# Altium project YLCmarlin1.PrjPCB
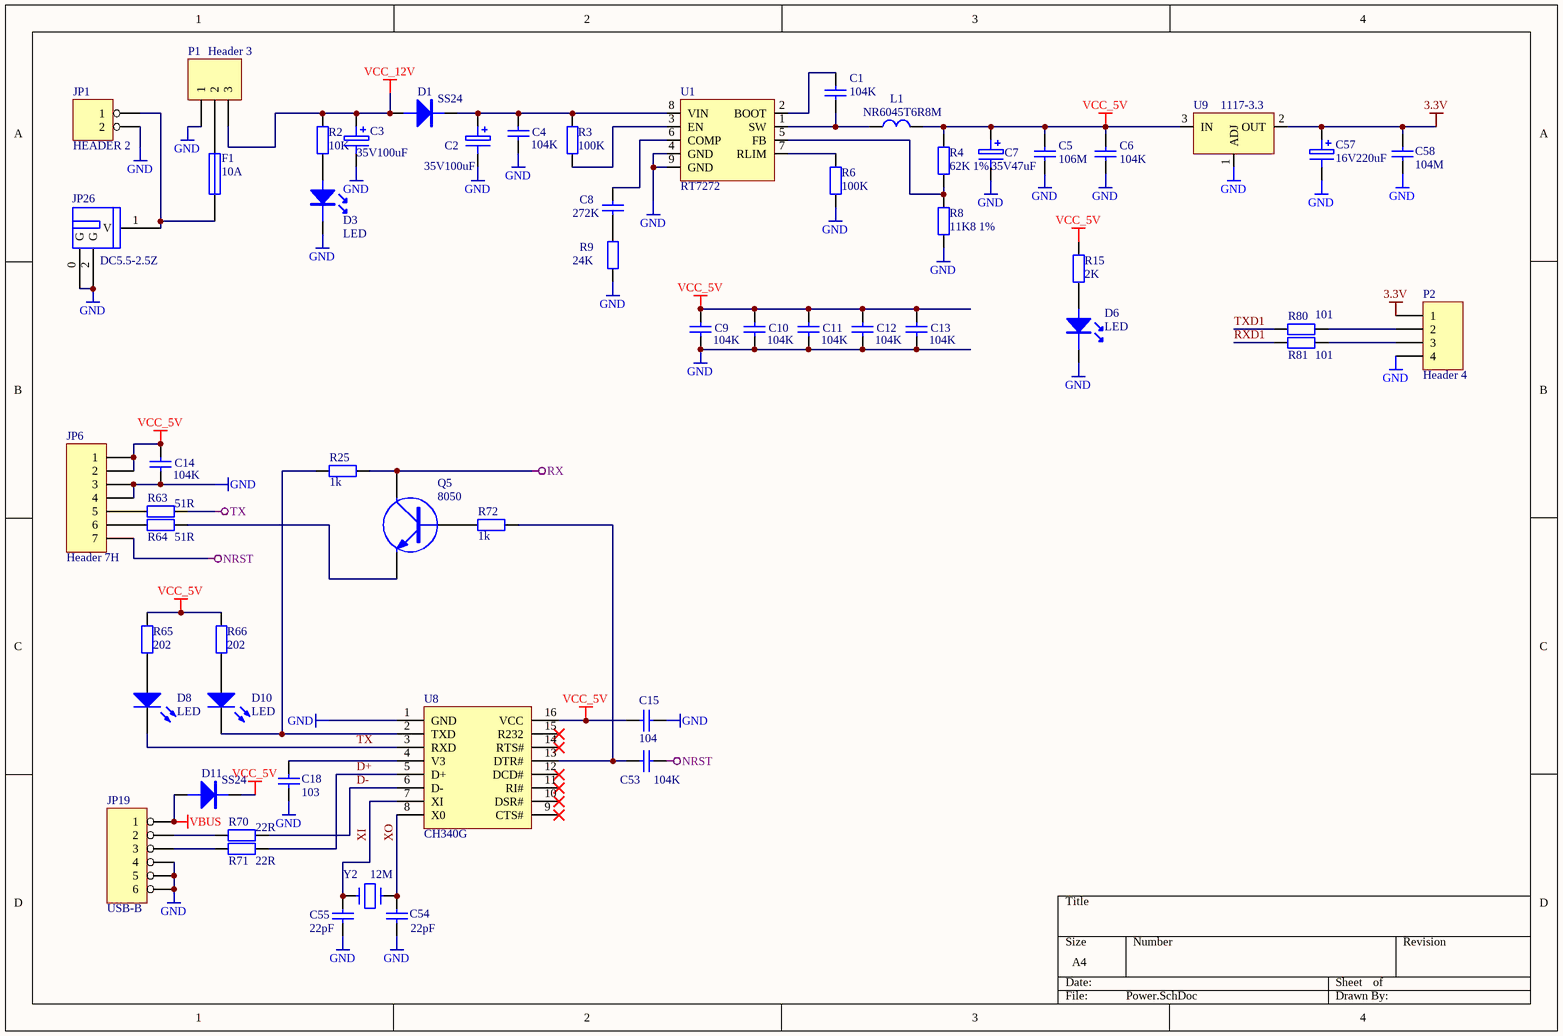
[diagram p0: Power.SchDoc]
4 sheets, 209 parts. Net scope: global (net labels, ports and power ports of the same name join across sheets).
Board file: YLCmarlin.PcbDoc
Sheets:
  Power.SchDoc
  MCU.SchDoc
  MOTO1.SchDoc
  misc.SchDoc

## Sheet Power.SchDoc
size A4

### Parts
C1  104K  [0805(CS)]
C2  35V100uF  [F6]
C3  35V100uF  [F6]
C4  104K  [0805(C)]
C5  106M  [0603(C)]
C6  104K  [0805(CS)]
C7  35V47uF  [F6]
C8  272K  [0603(C)]
C9  104K  [0805(CS)]
C10  104K  [0805(CS)]
C11  104K  [0805(CS)]
C12  104K  [0805(CS)]
C13  104K  [0805(CS)]
C14  104K  [0805(CS)]
C15  104  [0805(CS)]
C18  103  [0603(C)]
C53  104K  [0805(CS)]
C54  22pF  [0603(C)]
C55  22pF  [0603(C)]
C57  16V220uF  [F6]
C58  104M  [0603(C)]
D1  SS24  [SMA]
D3  LED  [LED-SMD-0805]
D6  LED  [LED-SMD-0805]
D8  LED  [LED-SMD-0805]
D10  LED  [LED-SMD-0805]
D11  SS24  [SMA]
F1  10A  [1206(F)]
JP1  HEADER 2  [POWER JACK-2*5.0]
JP6  Header 7H  [XH2.54-7P]
JP19  USB-B  [USBBW]
JP26  DC5.5-2.5Z  [DC-528]
L1  NR6045T6R8M  [COKE_6X6]
P1  Header 3  [POWER JACK-3*5.0]
P2  Header 4  [HDR1X4]
Q5  8050  [SOT23]
R2  10K  [0603(R)]
R3  100K  [0603(R)]
R4  62K 1%  [0603(R)]
R6  100K  [0603(R)]
R8  11K8 1%  [0603(R)]
R9  24K  [0603(R)]
R15  2K  [0603(R)]
R25  1k  [0603(R)]
R63  51R  [0603(R)]
R64  51R  [0603(R)]
R65  202  [0603(R)]
R66  202  [0603(R)]
R70  22R  [0603(R)]
R71  22R  [0603(R)]
R72  1k  [0603(R)]
R80  101  [0603(R)]
R81  101  [0603(R)]
U1  RT7272  [SO8-EP]
U8  CH340G  [SO-16]
U9  1117-3.3  [SOT223-1117]
Y2  12M  [CRYS-SMD-5032-2P]

### Nets
3.3V: C57.1 C58.2 P2.1 U9.2(OUT)
GND: C2.2 C3.2 C4.1 C5.1 C6.1 C7.2 C9.1 C10.1 C11.1 C12.1 C13.1 C14.1 C15.1 C18.1 C54.2 C55.2 C57.2 C58.1 D3.2 D6.2 JP1.2 JP6.3 JP6.4 JP19.4 JP19.5 JP19.6 JP26.0(G) JP26.2(G) P1.1 P2.4 R6.2 R8.2 R9.2 U1.4(GND) U1.9(GND) U8.1(GND) U9.1(ADJ)
NRST: C53.2 JP6.7
RX: Q5.3(C) R25.1
TX: D8.2(K) R63.2 U8.3(RXD)
VBUS: D11.1 JP19.1
VCC_5V: C5.2 C6.2 C7.1 C9.2 C10.2 C11.2 C12.2 C13.2 C14.2 C15.2 D11.2 JP6.1 JP6.2 L1.2 R4.1 R15.1 R65.2 R66.2 U8.16(VCC) U9.3(IN)
VCC_12V: C3.1 D1.1 P1.3 R2.1
D+: R71.2 U8.5(D+)
D-: R70.2 U8.6(D-)
RXD1: R81.1
TXD1: R80.1
XI: C55.1 U8.7(XI) Y2.1
XO: C54.1 U8.8(X0) Y2.2
NetC1_1: C1.1 L1.1 U1.1(SW)
NetC1_2: C1.2 U1.2(BOOT)
NetC2_1: C2.1 C4.2 D1.2 R3.1 U1.8(VIN)
NetC8_1: C8.1 R9.1
NetC8_2: C8.2 U1.6(COMP)
NetC18_2: C18.2 U8.4(V3)
NetC53_1: C53.1 R72.1 U8.13(DTR#)
NetD3_1: D3.1 R2.2
NetD6_1: D6.1 R15.2
NetD8_1: D8.1(A) R65.1
NetD10_1: D10.1(A) R66.1
NetD10_2: D10.2(K) R25.2 U8.2(TXD)
NetF1_1: F1.1 P1.2
NetF1_2: F1.2 JP1.1 JP26.1(V)
NetJP6_5: JP6.5 R63.1
NetJP6_6: JP6.6 R64.1
NetJP19_2: JP19.2 R70.1
NetJP19_3: JP19.3 R71.1
NetP2_2: P2.2 R80.2
NetP2_3: P2.3 R81.2
NetQ5_1: Q5.1(B) R72.2
NetQ5_2: Q5.2(E) R64.2
NetR3_2: R3.2 U1.3(EN)
NetR4_2: R4.2 R8.1 U1.5(FB)
NetR6_1: R6.1 U1.7(RLIM)

Not connected (* = marked no-connect by the designer): U8 9(CTS#)* 10(DSR#)* 11(RI#)* 12(DCD#)* 14(RTS#)* 15(R232)*

### Library data of the parts
C1 C4-C6 C8-C14 C58 = Cap: Capacitor; Value: 104; Published: 8-Jun-2000; LatestRevisionDate: 17-Jul-2002; LatestRevisionNote: Re-released for DXP Platform.; PackageReference: RAD-0.3; Publisher: Altium Limited; PackageDescription: Radial Cap, Thru-Hole; 2 Leads; 0.3 in Pin Spacing
C2 C3 C7 C57 = ELECTRO1: Electrolytic Capacitor
C15 C18 = CAP: Capacitor; Value: 0.1UF; Published: 8-Jun-2000; LatestRevisionDate: 17-Jul-2002; LatestRevisionNote: Re-released for DXP Platform.; PackageReference: RAD-0.3; Publisher: Altium Limited
C53-C55 = Cap: Capacitor; Value: 30pF; Published: 8-Jun-2000; LatestRevisionDate: 17-Jul-2002; LatestRevisionNote: Re-released for DXP Platform.; PackageReference: RAD-0.3; Publisher: Altium Limited; PackageDescription: Radial Cap, Thru-Hole; 2 Leads; 0.3 in Pin Spacing
D1 D11 = DIODE
D8 D10 = LED1: Typical RED GaAs LED; Published: 8-Jun-2000; LatestRevisionDate: 08-Jul-2005; LatestRevisionNote: Mech Layer 1 removed.; PackageReference: LED-1; Publisher: Altium Limited; PackageDescription: LED; 2 Leads
F1 = FUSE1: Fuse
JP6 = Header 7H: Header, 7-Pin, Right Angle; LatestRevisionDate: 17-Jul-2002; LatestRevisionNote: Re-released for DXP Platform.; Publisher: Altium Limited
JP19 = HEADER 6
L1 = INDUCTOR
P1 = Header 3: Header, 3-Pin; LatestRevisionDate: 17-Jul-2002; LatestRevisionNote: Re-released for DXP Platform.; Publisher: Altium Limited
P2 = Header 4: Header, 4-Pin; LatestRevisionDate: 17-Jul-2002; LatestRevisionNote: Re-released for DXP Platform.; Publisher: Altium Limited
Q5 = NPN: NPN Transistor
R2-R4 R6 R8 R9 R15 R25 R63-R66 R70-R72 R80 R81 = Res2: Resistor; Value: 1K5; Published: 8-Jun-2000; LatestRevisionDate: 17-Jul-2002; LatestRevisionNote: Re-released for DXP Platform.; PackageReference: AXIAL-0.4; Publisher: Altium Limited; PackageDescription: Axial Device, Thru-Hole; 2 Leads; 0.4 in Pin Spacing
U9 = 1117
Y2 = CRYSTAL

## Sheet MCU.SchDoc
size A4
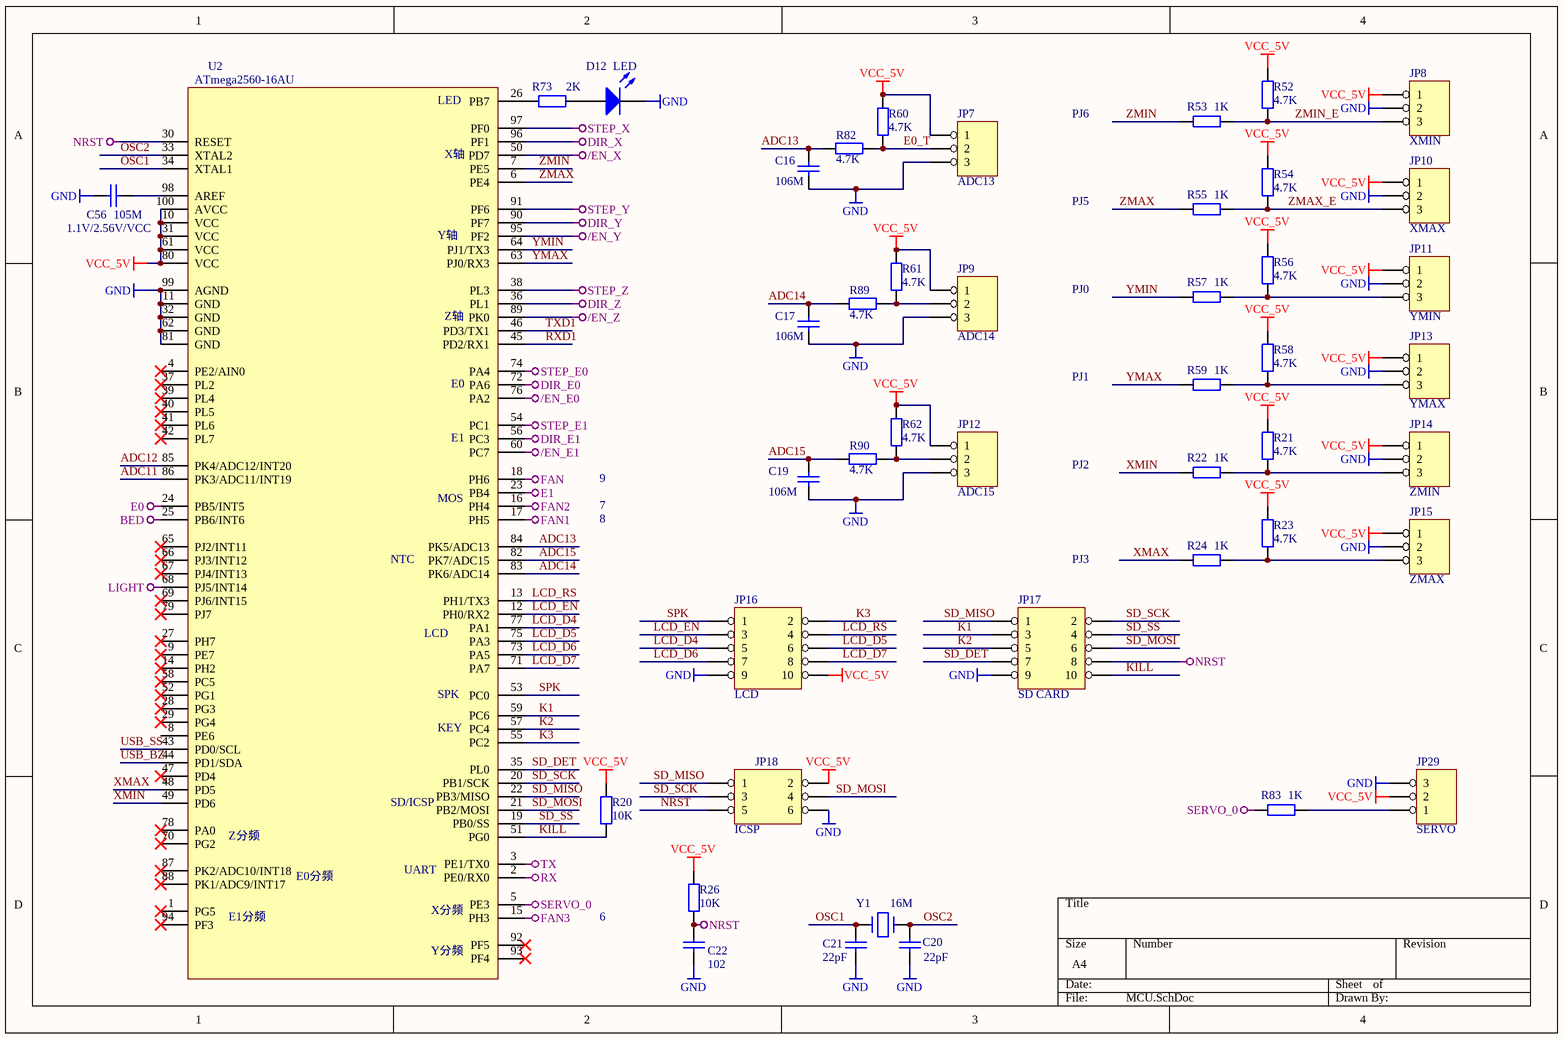
[diagram p1: MCU.SchDoc]

### Parts
C16  106M  [0603(C)]
C17  106M  [0603(C)]
C19  106M  [0603(C)]
C20  22pF  [0603(C)]
C21  22pF  [0603(C)]
C22  102  [0603(C)]
C56  105M  [0603(C)]
D12  LED  [LED-SMD-0805]
JP7  ADC13  [XH2.54-3P]
JP8  XMIN  [XH2.54-3P]
JP9  ADC14  [XH2.54-3P]
JP10  XMAX  [XH2.54-3P]
JP11  YMIN  [XH2.54-3P]
JP12  ADC15  [XH2.54-3P]
JP13  YMAX  [XH2.54-3P]
JP14  ZMIN  [XH2.54-3P]
JP15  ZMAX  [XH2.54-3P]
JP16  LCD  [IDC10-BASE]
JP17  SD CARD  [IDC10-BASE]
JP18  ICSP  [IDC6X2.54]
JP29  SERVO  [XH2.54-3P]
R20  10K  [0603(R)]
R21  4.7K  [0603(R)]
R22  1K  [0603(R)]
R23  4.7K  [0603(R)]
R24  1K  [0603(R)]
R26  10K  [0603(R)]
R52  4.7K  [0603(R)]
R53  1K  [0603(R)]
R54  4.7K  [0603(R)]
R55  1K  [0603(R)]
R56  4.7K  [0603(R)]
R57  1K  [0603(R)]
R58  4.7K  [0603(R)]
R59  1K  [0603(R)]
R60  4.7K  [0603(R)]
R61  4.7K  [0603(R)]
R62  4.7K  [0603(R)]
R73  2K  [0603(R)]
R82  4.7K  [0603(R)]
R83  1K  [0603(R)]
R89  4.7K  [0603(R)]
R90  4.7K  [0603(R)]
U2  ATmega2560-16AU  [LQFP100]
Y1  16M  [CRYS-SMD-5032-2P]

### Nets
/EN_E0: U2.76(PA2)
/EN_E1: U2.60(PC7)
/EN_X: U2.50(PD7)
/EN_Y: U2.95(PF2)
/EN_Z: U2.89(PK0)
BED: U2.25(PB6/INT6)
DIR_E0: U2.72(PA6)
DIR_E1: U2.56(PC3)
DIR_X: U2.96(PF1)
DIR_Y: U2.90(PF7)
DIR_Z: U2.36(PL1)
E0: U2.24(PB5/INT5)
E1: U2.23(PB4)
FAN: U2.18(PH6)
FAN1: U2.17(PH5)
FAN2: U2.16(PH4)
FAN3: U2.15(PH3)
GND: C16.1 C17.1 C19.1 C20.2 C21.2 C22.2 C56.2 D12.2(K) JP7.3 JP8.2 JP9.3 JP10.2 JP11.2 JP12.3 JP13.2 JP14.2 JP15.2 JP16.9 JP17.9 JP18.6 JP29.3 U2.11(GND) U2.32(GND) U2.62(GND) U2.81(GND) U2.99(AGND)
LIGHT: U2.68(PJ5/INT14)
NRST: C22.1 JP17.8 JP18.5 R26.1 U2.30(RESET)
RX: U2.2(PE0/RX0)
SERVO_0: R83.2 U2.5(PE3)
STEP_E0: U2.74(PA4)
STEP_E1: U2.54(PC1)
STEP_X: U2.97(PF0)
STEP_Y: U2.91(PF6)
STEP_Z: U2.38(PL3)
TX: U2.3(PE1/TX0)
VCC_5V: JP7.1 JP8.1 JP9.1 JP10.1 JP11.1 JP12.1 JP13.1 JP14.1 JP15.1 JP16.10 JP18.2 JP29.2 R20.2 R21.1 R23.1 R26.2 R52.1 R54.1 R56.1 R58.1 R60.1 R61.1 R62.1 U2.10(VCC) U2.31(VCC) U2.61(VCC) U2.80(VCC) U2.100(AVCC)
ADC11: U2.86(PK3/ADC11/INT19)
ADC12: U2.85(PK4/ADC12/INT20)
ADC13: C16.2 R82.1 U2.84(PK5/ADC13)
ADC14: C17.2 R89.1 U2.83(PK6/ADC14)
ADC15: C19.2 R90.1 U2.82(PK7/ADC15)
E0_T: JP7.2 R60.2 R82.2
K1: JP17.3 U2.59(PC6)
K2: JP17.5 U2.57(PC4)
K3: JP16.2 U2.55(PC2)
KILL: JP17.10 R20.1 U2.51(PG0)
LCD_D4: JP16.5 U2.77(PA1)
LCD_D5: JP16.6 U2.75(PA3)
LCD_D6: JP16.7 U2.73(PA5)
LCD_D7: JP16.8 U2.71(PA7)
LCD_EN: JP16.3 U2.12(PH0/RX2)
LCD_RS: JP16.4 U2.13(PH1/TX3)
OSC1: C21.1 U2.34(XTAL1) Y1.1
OSC2: C20.1 U2.33(XTAL2) Y1.2
RXD1: U2.45(PD2/RX1)
SD_DET: JP17.7 U2.35(PL0)
SD_MISO: JP17.1 JP18.1 U2.22(PB3/MISO)
SD_MOSI: JP17.6 JP18.4 U2.21(PB2/MOSI)
SD_SCK: JP17.2 JP18.3 U2.20(PB1/SCK)
SD_SS: JP17.4 U2.19(PB0/SS)
SPK: JP16.1 U2.53(PC0)
TXD1: U2.46(PD3/TX1)
USB_BZ: U2.44(PD1/SDA)
USB_SS: U2.43(PD0/SCL)
XMAX: R24.2 U2.48(PD5)
XMIN: R22.2 U2.49(PD6)
YMAX: R59.2 U2.63(PJ0/RX3)
YMIN: R57.2 U2.64(PJ1/TX3)
ZMAX: R55.2 U2.6(PE4)
ZMAX_E: JP10.3 R54.2 R55.1
ZMIN: R53.2 U2.7(PE5)
ZMIN_E: JP8.3 R52.2 R53.1
NetC56_1: C56.1 U2.98(AREF)
NetD12_1: D12.1(A) R73.2
NetJP9_2: JP9.2 R61.2 R89.2
NetJP11_3: JP11.3 R56.2 R57.1
NetJP12_2: JP12.2 R62.2 R90.2
NetJP13_3: JP13.3 R58.2 R59.1
NetJP14_3: JP14.3 R21.2 R22.1
NetJP15_3: JP15.3 R23.2 R24.1
NetJP29_1: JP29.1 R83.1
NetR73_1: R73.1 U2.26(PB7)

Not connected (* = marked no-connect by the designer): U2 1(PG5)* 4(PE2/AIN0)* 8(PE6) 9(PE7)* 14(PH2)* 27(PH7)* 28(PG3)* 29(PG4)* 37(PL2)* 39(PL4)* 40(PL5)* 41(PL6)* 42(PL7)* 47(PD4)* 52(PG1)* 58(PC5)* 65(PJ2/INT11)* 66(PJ3/INT12)* 67(PJ4/INT13)* 69(PJ6/INT15)* 70(PG2)* 78(PA0)* 79(PJ7)* 87(PK2/ADC10/INT18)* 88(PK1/ADC9/INT17)* 92(PF5)* 93(PF4)* 94(PF3)*

### Notes on the sheet
- PJ6
- 1.1V/2.56V/VCC
- PJ5
- PJ0
- PJ1
- 9
- 7
- 8
- PJ2
- PJ3
- 6
- (in symbol ATmega2560) LED; X轴; Y轴; Z轴; E0; E1; MOS; NTC; LCD; SPK; KEY; SD/ICSP; Z分频; UART; E0分频; X分频; E1分频; Y分频

### Library data of the parts
C16 C17 C19 C56 = Cap: Capacitor; Value: 104; Published: 8-Jun-2000; LatestRevisionDate: 17-Jul-2002; LatestRevisionNote: Re-released for DXP Platform.; PackageReference: RAD-0.3; Publisher: Altium Limited; PackageDescription: Radial Cap, Thru-Hole; 2 Leads; 0.3 in Pin Spacing
C20-C22 = Cap: Capacitor; Value: 30pF; Published: 8-Jun-2000; LatestRevisionDate: 17-Jul-2002; LatestRevisionNote: Re-released for DXP Platform.; PackageReference: RAD-0.3; Publisher: Altium Limited; PackageDescription: Radial Cap, Thru-Hole; 2 Leads; 0.3 in Pin Spacing
D12 = LED1: Typical RED GaAs LED; Published: 8-Jun-2000; LatestRevisionDate: 08-Jul-2005; LatestRevisionNote: Mech Layer 1 removed.; PackageReference: LED-1; Publisher: Altium Limited; PackageDescription: LED; 2 Leads
JP7-JP15 JP29 = HEADER 3
JP16 JP17 = HEADER 5X2
JP18 = HEADER 3X2
R20 R21 R23 R26 R52 R54 R56 R58 R60-R62 R82 R89 R90 = Res2: 1K; Published: 8-Jun-2000; LatestRevisionDate: 17-Jul-2002; LatestRevisionNote: Re-released for DXP Platform.; PackageReference: AXIAL-0.4; Publisher: Altium Limited; PackageDescription: Axial Device, Thru-Hole; 2 Leads; 0.4 in Pin Spacing; Value: 1K
R22 R24 R53 R55 R57 R59 R83 = Res2: Published: 8-Jun-2000; LatestRevisionDate: 17-Jul-2002; LatestRevisionNote: Re-released for DXP Platform.; PackageReference: AXIAL-0.4; Publisher: Altium Limited; PackageDescription: Axial Device, Thru-Hole; 2 Leads; 0.4 in Pin Spacing; Value: 1K
R73 = Res2: Resistor
U2 = ATmega2560
Y1 = CRYSTAL

## Sheet MOTO1.SchDoc
size A4
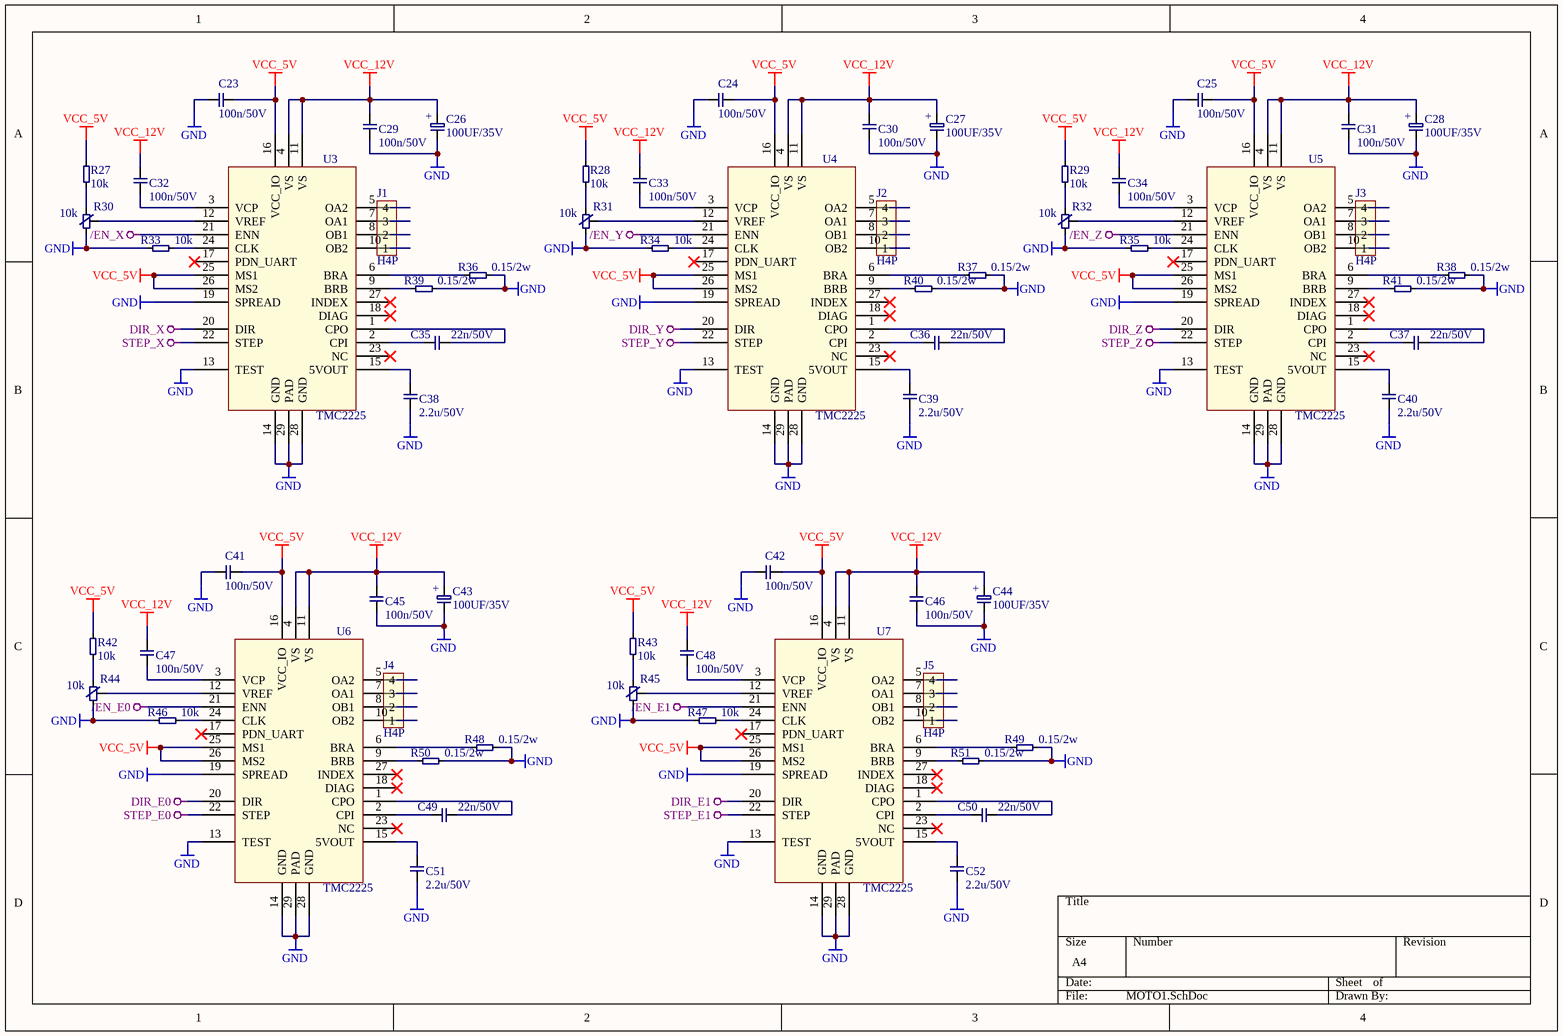
[diagram p2: MOTO1.SchDoc]

### Parts
C23  100n/50V  [C0603(1608)]
C24  100n/50V  [C0603(1608)]
C25  100n/50V  [C0603(1608)]
C26  100UF/35V  [C6.3x7.7贴片铝电解电容]
C27  100UF/35V  [C6.3x7.7贴片铝电解电容]
C28  100UF/35V  [C6.3x7.7贴片铝电解电容]
C29  100n/50V  [C0603(1608)]
C30  100n/50V  [C0603(1608)]
C31  100n/50V  [C0603(1608)]
C32  100n/50V  [C0603(1608)]
C33  100n/50V  [C0603(1608)]
C34  100n/50V  [C0603(1608)]
C35  22n/50V  [C0603(1608)]
C36  22n/50V  [C0603(1608)]
C37  22n/50V  [C0603(1608)]
C38  2.2u/50V  [C0805(2012)]
C39  2.2u/50V  [C0805(2012)]
C40  2.2u/50V  [C0805(2012)]
C41  100n/50V  [C0603(1608)]
C42  100n/50V  [C0603(1608)]
C43  100UF/35V  [C6.3x7.7贴片铝电解电容]
C44  100UF/35V  [C6.3x7.7贴片铝电解电容]
C45  100n/50V  [C0603(1608)]
C46  100n/50V  [C0603(1608)]
C47  100n/50V  [C0603(1608)]
C48  100n/50V  [C0603(1608)]
C49  22n/50V  [C0603(1608)]
C50  22n/50V  [C0603(1608)]
C51  2.2u/50V  [C0805(2012)]
C52  2.2u/50V  [C0805(2012)]
J1  H4P  [XH2.54(2.5mm)x4P]
J2  H4P  [XH2.54(2.5mm)x4P]
J3  H4P  [XH2.54(2.5mm)x4P]
J4  H4P  [XH2.54(2.5mm)x4P]
J5  H4P  [XH2.54(2.5mm)x4P]
R27  10k  [R0603(1608)]
R28  10k  [R0603(1608)]
R29  10k  [R0603(1608)]
R30  10k  [R3x3-贴片电位器]
R31  10k  [R3x3-贴片电位器]
R32  10k  [R3x3-贴片电位器]
R33  10k  [R0603(1608)]
R34  10k  [R0603(1608)]
R35  10k  [R0603(1608)]
R36  0.15/2w  [R2512]
R37  0.15/2w  [R2512]
R38  0.15/2w  [R2512]
R39  0.15/2w  [R2512]
R40  0.15/2w  [R2512]
R41  0.15/2w  [R2512]
R42  10k  [R0603(1608)]
R43  10k  [R0603(1608)]
R44  10k  [R3x3-贴片电位器]
R45  10k  [R3x3-贴片电位器]
R46  10k  [R0603(1608)]
R47  10k  [R0603(1608)]
R48  0.15/2w  [R2512]
R49  0.15/2w  [R2512]
R50  0.15/2w  [R2512]
R51  0.15/2w  [R2512]
U3  TMC2225  [HTSSOP28]
U4  TMC2225  [HTSSOP28]
U5  TMC2225  [HTSSOP28]
U6  TMC2225  [HTSSOP28]
U7  TMC2225  [HTSSOP28]

### Nets
/EN_E0: U6.21(ENN)
/EN_E1: U7.21(ENN)
/EN_X: U3.21(ENN)
/EN_Y: U4.21(ENN)
/EN_Z: U5.21(ENN)
DIR_E0: U6.20(DIR)
DIR_E1: U7.20(DIR)
DIR_X: U3.20(DIR)
DIR_Y: U4.20(DIR)
DIR_Z: U5.20(DIR)
GND: C23.2 C24.2 C25.2 C26.2 C27.2 C28.2 C29.2 C30.2 C31.2 C38.2 C39.2 C40.2 C41.2 C42.2 C43.2 C44.2 C45.2 C46.2 C51.2 C52.2 R30.3 R31.3 R32.3 R33.2 R34.2 R35.2 R36.1 R37.1 R38.1 R39.1 R40.1 R41.1 R44.3 R45.3 R46.2 R47.2 R48.1 R49.1 R50.1 R51.1 U3.13(TEST) U3.14(GND) U3.19(SPREAD) U3.28(GND) U3.29(PAD) U4.13(TEST) U4.14(GND) U4.19(SPREAD) U4.28(GND) U4.29(PAD) U5.13(TEST) U5.14(GND) U5.19(SPREAD) U5.28(GND) U5.29(PAD) U6.13(TEST) U6.14(GND) U6.19(SPREAD) U6.28(GND) U6.29(PAD) U7.13(TEST) U7.14(GND) U7.19(SPREAD) U7.28(GND) U7.29(PAD)
STEP_E0: U6.22(STEP)
STEP_E1: U7.22(STEP)
STEP_X: U3.22(STEP)
STEP_Y: U4.22(STEP)
STEP_Z: U5.22(STEP)
VCC_5V: C23.1 C24.1 C25.1 C41.1 C42.1 R27.2 R28.2 R29.2 R42.2 R43.2 U3.16(VCC_IO) U3.25(MS1) U3.26(MS2) U4.16(VCC_IO) U4.25(MS1) U4.26(MS2) U5.16(VCC_IO) U5.25(MS1) U5.26(MS2) U6.16(VCC_IO) U6.25(MS1) U6.26(MS2) U7.16(VCC_IO) U7.25(MS1) U7.26(MS2)
VCC_12V: C26.1 C27.1 C28.1 C29.1 C30.1 C31.1 C32.1 C33.1 C34.1 C43.1 C44.1 C45.1 C46.1 C47.1 C48.1 U3.4(VS) U3.11(VS) U4.4(VS) U4.11(VS) U5.4(VS) U5.11(VS) U6.4(VS) U6.11(VS) U7.4(VS) U7.11(VS)
NetC32_2: C32.2 U3.3(VCP)
NetC33_2: C33.2 U4.3(VCP)
NetC34_2: C34.2 U5.3(VCP)
NetC35_1: C35.1 U3.2(CPI)
NetC35_2: C35.2 U3.1(CPO)
NetC36_1: C36.1 U4.2(CPI)
NetC36_2: C36.2 U4.1(CPO)
NetC37_1: C37.1 U5.2(CPI)
NetC37_2: C37.2 U5.1(CPO)
NetC38_1: C38.1 U3.15(5VOUT)
NetC39_1: C39.1 U4.15(5VOUT)
NetC40_1: C40.1 U5.15(5VOUT)
NetC47_2: C47.2 U6.3(VCP)
NetC48_2: C48.2 U7.3(VCP)
NetC49_1: C49.1 U6.2(CPI)
NetC49_2: C49.2 U6.1(CPO)
NetC50_1: C50.1 U7.2(CPI)
NetC50_2: C50.2 U7.1(CPO)
NetC51_1: C51.1 U6.15(5VOUT)
NetC52_1: C52.1 U7.15(5VOUT)
NetJ1_1: J1.1 U3.10(OB2)
NetJ1_2: J1.2 U3.8(OB1)
NetJ1_3: J1.3 U3.7(OA1)
NetJ1_4: J1.4 U3.5(OA2)
NetJ2_1: J2.1 U4.10(OB2)
NetJ2_2: J2.2 U4.8(OB1)
NetJ2_3: J2.3 U4.7(OA1)
NetJ2_4: J2.4 U4.5(OA2)
NetJ3_1: J3.1 U5.10(OB2)
NetJ3_2: J3.2 U5.8(OB1)
NetJ3_3: J3.3 U5.7(OA1)
NetJ3_4: J3.4 U5.5(OA2)
NetJ4_1: J4.1 U6.10(OB2)
NetJ4_2: J4.2 U6.8(OB1)
NetJ4_3: J4.3 U6.7(OA1)
NetJ4_4: J4.4 U6.5(OA2)
NetJ5_1: J5.1 U7.10(OB2)
NetJ5_2: J5.2 U7.8(OB1)
NetJ5_3: J5.3 U7.7(OA1)
NetJ5_4: J5.4 U7.5(OA2)
NetR27_1: R27.1 R30.1
NetR28_1: R28.1 R31.1
NetR29_1: R29.1 R32.1
NetR30_2: R30.2 U3.12(VREF)
NetR31_2: R31.2 U4.12(VREF)
NetR32_2: R32.2 U5.12(VREF)
NetR33_1: R33.1 U3.24(CLK)
NetR34_1: R34.1 U4.24(CLK)
NetR35_1: R35.1 U5.24(CLK)
NetR36_2: R36.2 U3.6(BRA)
NetR37_2: R37.2 U4.6(BRA)
NetR38_2: R38.2 U5.6(BRA)
NetR39_2: R39.2 U3.9(BRB)
NetR40_2: R40.2 U4.9(BRB)
NetR41_2: R41.2 U5.9(BRB)
NetR42_1: R42.1 R44.1
NetR43_1: R43.1 R45.1
NetR44_2: R44.2 U6.12(VREF)
NetR45_2: R45.2 U7.12(VREF)
NetR46_1: R46.1 U6.24(CLK)
NetR47_1: R47.1 U7.24(CLK)
NetR48_2: R48.2 U6.6(BRA)
NetR49_2: R49.2 U7.6(BRA)
NetR50_2: R50.2 U6.9(BRB)
NetR51_2: R51.2 U7.9(BRB)

Not connected (* = marked no-connect by the designer): U3 17(PDN_UART)* 18(DIAG)* 23(NC)* 27(INDEX)*; U4 17(PDN_UART)* 18(DIAG)* 23(NC)* 27(INDEX)*; U5 17(PDN_UART)* 18(DIAG)* 23(NC)* 27(INDEX)*; U6 17(PDN_UART)* 18(DIAG)* 23(NC)* 27(INDEX)*; U7 17(PDN_UART)* 18(DIAG)* 23(NC)* 27(INDEX)*

### Notes on the sheet
- (in symbol Capsp) +

### Library data of the parts
C23-C25 C29-C42 C45-C52 = Caps
C26-C28 C43 C44 = Capsp
R27-R29 R33-R43 R46-R51 = Ress
R30-R32 R44 R45 = Resc

## Sheet misc.SchDoc
size A4
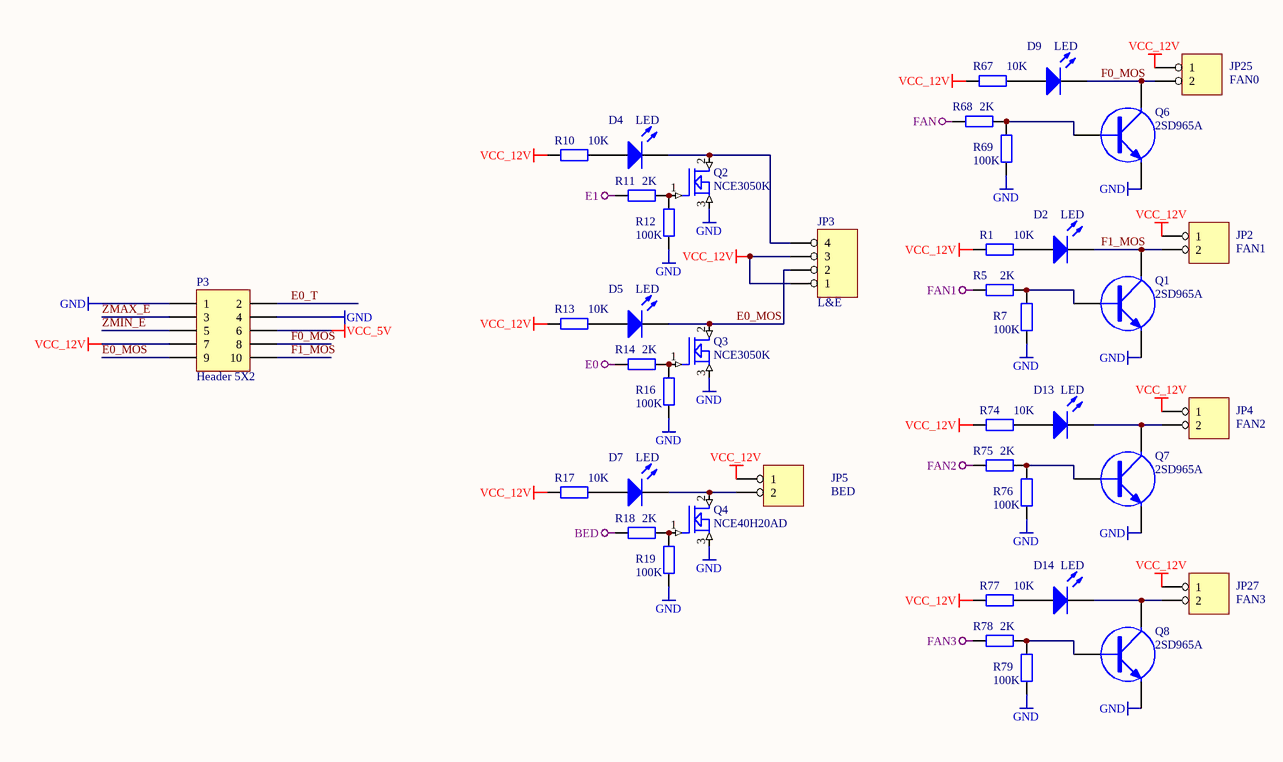
[diagram p3: misc.SchDoc]

### Parts
D2  LED  [LED-SMD-0805]
D4  LED  [LED-SMD-0805]
D5  LED  [LED-SMD-0805]
D7  LED  [LED-SMD-0805]
D9  LED  [LED-SMD-0805]
D13  LED  [LED-SMD-0805]
D14  LED  [LED-SMD-0805]
JP2  FAN1  [XH2.54-2P]
JP3  L&E  [KF127-4*5.0]
JP4  FAN2  [XH2.54-2P]
JP5  BED  [POWER JACK-2*5.0]
JP25  FAN0  [XH2.54-2P]
JP27  FAN3  [XH2.54-2P]
P3  Header 5X2  [HX30002-10A]
Q1  2SD965A  [SOT89-3357]
Q2  NCE3050K  [TO252]
Q3  NCE3050K  [TO252]
Q4  NCE40H20AD  [TO263-S]
Q6  2SD965A  [SOT89-3357]
Q7  2SD965A  [SOT89-3357]
Q8  2SD965A  [SOT89-3357]
R1  10K  [0603(R)]
R5  2K  [0603(R)]
R7  100K  [0603(R)]
R10  10K  [0603(R)]
R11  2K  [0603(R)]
R12  100K  [0603(R)]
R13  10K  [0603(R)]
R14  2K  [0603(R)]
R16  100K  [0603(R)]
R17  10K  [0603(R)]
R18  2K  [0603(R)]
R19  100K  [0603(R)]
R67  10K  [0603(R)]
R68  2K  [0603(R)]
R69  100K  [0603(R)]
R74  10K  [0603(R)]
R75  2K  [0603(R)]
R76  100K  [0603(R)]
R77  10K  [0603(R)]
R78  2K  [0603(R)]
R79  100K  [0603(R)]

### Nets
BED: R18.1
E0: R14.1
E1: R11.1
FAN: R68.1
FAN1: R5.1
FAN2: R75.1
FAN3: R78.1
GND: P3.1 P3.4 Q1.2(E) Q2.3(S) Q3.3(S) Q4.3(S) Q6.2(E) Q7.2(E) Q8.2(E) R7.1 R12.1 R16.1 R19.1 R69.1 R76.1 R79.1
VCC_5V: P3.6
VCC_12V: JP2.1 JP3.1 JP3.3 JP4.1 JP5.1 JP25.1 JP27.1 P3.7 R1.1 R10.1 R13.1 R17.1 R67.1 R74.1 R77.1
E0_MOS: D5.2(K) JP3.2 P3.9 Q3.2(D)
E0_T: P3.2
F0_MOS: D9.2(K) JP25.2 P3.8 Q6.3(C)
F1_MOS: D2.2(K) JP2.2 P3.10 Q1.3(C)
ZMAX_E: P3.3
ZMIN_E: P3.5
NetD2_1: D2.1(A) R1.2
NetD4_1: D4.1(A) R10.2
NetD4_2: D4.2(K) JP3.4 Q2.2(D)
NetD5_1: D5.1(A) R13.2
NetD7_1: D7.1(A) R17.2
NetD7_2: D7.2(K) JP5.2 Q4.2(D)
NetD9_1: D9.1(A) R67.2
NetD13_1: D13.1(A) R74.2
NetD13_2: D13.2(K) JP4.2 Q7.3(C)
NetD14_1: D14.1(A) R77.2
NetD14_2: D14.2(K) JP27.2 Q8.3(C)
NetQ1_1: Q1.1(B) R5.2 R7.2
NetQ2_1: Q2.1(G) R11.2 R12.2
NetQ3_1: Q3.1(G) R14.2 R16.2
NetQ4_1: Q4.1(G) R18.2 R19.2
NetQ6_1: Q6.1(B) R68.2 R69.2
NetQ7_1: Q7.1(B) R75.2 R76.2
NetQ8_1: Q8.1(B) R78.2 R79.2

### Library data of the parts
D2 D4 D5 D7 D9 D13 D14 = LED1: Typical RED GaAs LED; Published: 8-Jun-2000; LatestRevisionDate: 08-Jul-2005; LatestRevisionNote: Mech Layer 1 removed.; PackageReference: LED-1; Publisher: Altium Limited; PackageDescription: LED; 2 Leads
JP2 JP4 JP5 JP25 JP27 = HEADER 2
JP3 = 4 HEADER: 4 Pin Header
P3 = Header 5X2: Header, 5-Pin, Dual row; LatestRevisionDate: 17-Jul-2002; LatestRevisionNote: Re-released for DXP Platform.; Publisher: Altium Limited
Q1 Q6-Q8 = NPN: NPN Transistor
Q2-Q4 = NMOS
R1 R10 R13 R17 R67 R74 R77 = Res2: Resistor
R5 R7 R11 R12 R14 R16 R18 R19 R68 R69 R75 R76 R78 R79 = Res2: 1K; Published: 8-Jun-2000; LatestRevisionDate: 17-Jul-2002; LatestRevisionNote: Re-released for DXP Platform.; PackageReference: AXIAL-0.4; Publisher: Altium Limited; PackageDescription: Axial Device, Thru-Hole; 2 Leads; 0.4 in Pin Spacing; Value: 1K

## Nets that join several sheets
/EN_E0: MCU (U2.76), MOTO1 (U6.21)
/EN_E1: MCU (U2.60), MOTO1 (U7.21)
/EN_X: MCU (U2.50), MOTO1 (U3.21)
/EN_Y: MCU (U2.95), MOTO1 (U4.21)
/EN_Z: MCU (U2.89), MOTO1 (U5.21)
BED: MCU (U2.25), misc (R18.1)
DIR_E0: MCU (U2.72), MOTO1 (U6.20)
DIR_E1: MCU (U2.56), MOTO1 (U7.20)
DIR_X: MCU (U2.96), MOTO1 (U3.20)
DIR_Y: MCU (U2.90), MOTO1 (U4.20)
DIR_Z: MCU (U2.36), MOTO1 (U5.20)
E0: MCU (U2.24), misc (R14.1)
E1: MCU (U2.23), misc (R11.1)
FAN: MCU (U2.18), misc (R68.1)
FAN1: MCU (U2.17), misc (R5.1)
FAN2: MCU (U2.16), misc (R75.1)
FAN3: MCU (U2.15), misc (R78.1)
GND: Power (37 pins), MCU (26 pins), MOTO1 (65 pins), misc (16 pins)
NRST: Power (C53.2 JP6.7), MCU (5 pins)
RX: Power (Q5.3 R25.1), MCU (U2.2)
STEP_E0: MCU (U2.74), MOTO1 (U6.22)
STEP_E1: MCU (U2.54), MOTO1 (U7.22)
STEP_X: MCU (U2.97), MOTO1 (U3.22)
STEP_Y: MCU (U2.91), MOTO1 (U4.22)
STEP_Z: MCU (U2.38), MOTO1 (U5.22)
TX: Power (D8.2 R63.2 U8.3), MCU (U2.3)
VCC_5V: Power (20 pins), MCU (28 pins), MOTO1 (25 pins), misc (P3.6)
VCC_12V: Power (C3.1 D1.1 P1.3 R2.1), MOTO1 (25 pins), misc (15 pins)
E0_T: MCU (JP7.2 R60.2 R82.2), misc (P3.2)
RXD1: Power (R81.1), MCU (U2.45)
TXD1: Power (R80.1), MCU (U2.46)
ZMAX_E: MCU (JP10.3 R54.2 R55.1), misc (P3.3)
ZMIN_E: MCU (JP8.3 R52.2 R53.1), misc (P3.5)